# EAGLE design EchoHelloBoard2 (EAGLE 7.2.0)
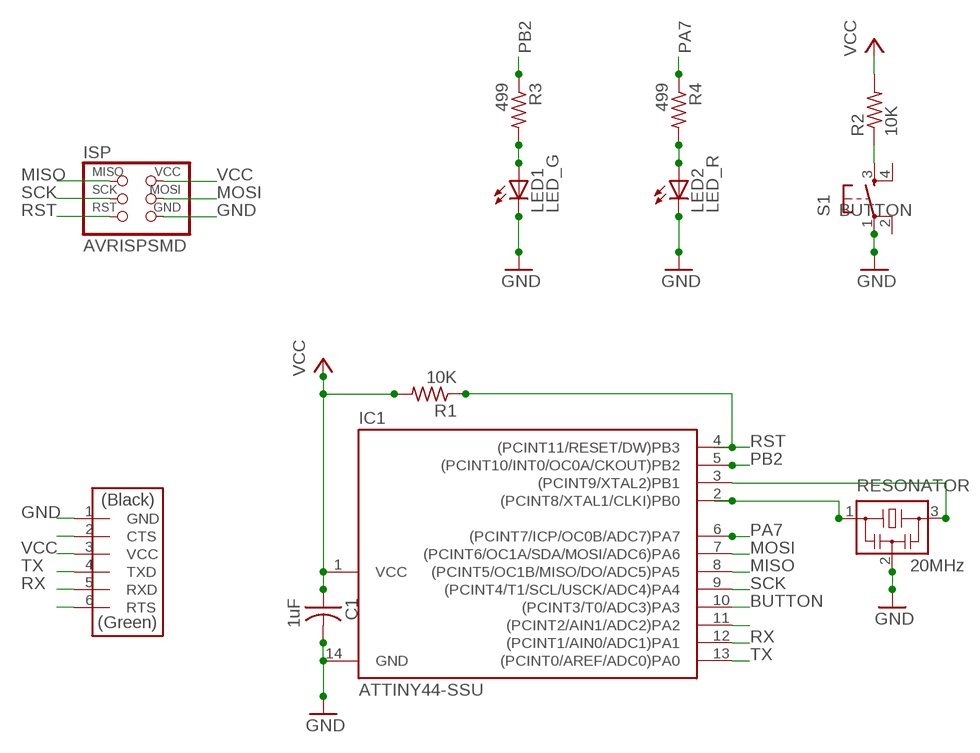
[diagram p0: schematic, sheet 1]

## Parts
C1  1uF  CAP-US1206FAB  [C1206FAB]
IC1  ATTINY44-SSU  [SOIC14]
ISP  AVRISPSMD  [2X03SMD]
LED1  LED_G  LEDFAB1206  [LED1206FAB]
LED2  LED_R  LEDFAB1206  [LED1206FAB]
R1  10K  RES-US1206FAB  [R1206FAB]
R2  10K  RES-US1206FAB  [R1206FAB]
R3  499  RES-US1206FAB  [R1206FAB]
R4  499  RES-US1206FAB  [R1206FAB]
RESONATOR  20MHz  RESONATOR  [EFOBM]
S1  6MM_SWITCH6MM_SWITCH  [6MM_SWITCH]
U$2  FTDI-SMD-HEADER  [1X06SMD]

## Nets
BUTTON: IC1.10((PCINT3/T0/ADC3)PA3) R2.1 S1.3(S)
GND: C1.2 IC1.14(GND) ISP.6(GND) LED1.2(C) LED2.2(C) RESONATOR.2 S1.1(P) U$2.1(GND)
MISO: IC1.8((PCINT5/OC1B/MISO/DO/ADC5)PA5) ISP.1(MISO)
MOSI: IC1.7((PCINT6/OC1A/SDA/MOSI/ADC6)PA6) ISP.4(MOSI)
N$1: IC1.3((PCINT9/XTAL2)PB1) RESONATOR.3
N$3: IC1.2((PCINT8/XTAL1/CLKI)PB0) RESONATOR.1
N$5: LED1.1(A) R3.2
N$6: LED2.1(A) R4.2
N$10: IC1.11((PCINT2/AIN1/ADC2)PA2)
N$19: U$2.2(CTS)
N$23: U$2.6(RTS)
PA7: IC1.6((PCINT7/ICP/OC0B/ADC7)PA7) R4.1
PB2: IC1.5((PCINT10/INT0/OC0A/CKOUT)PB2) R3.1
RST: IC1.4((PCINT11/RESET/DW)PB3) ISP.5(RST) R1.1
RX: IC1.12((PCINT1/AIN0/ADC1)PA1) U$2.5(RXD)
SCK: IC1.9((PCINT4/T1/SCL/USCK/ADC4)PA4) ISP.3(SCK)
TX: IC1.13((PCINT0/AREF/ADC0)PA0) U$2.4(TXD)
VCC: C1.1 IC1.1(VCC) ISP.2(VCC) R1.2 R2.2 U$2.3(VCC)
Unconnected: S1.2(P1) S1.4(S1)

## Library data of the parts
C1 = fab:CAP-US
IC1 = fab:ATTINY44
ISP = fab:AVRISP
LED1 LED2 = fab:LED: LED
R1-R4 = fab:RES-US: Resistor (US Symbol) Variants with postfix FAB are widened to allow the routing of internal traces
RESONATOR = fab:RESONATOR
S1 = fab:6MM_SWITCH: OMRON SWITCH
U$2 = fab:FTDI-SMD-HEADER

## Board
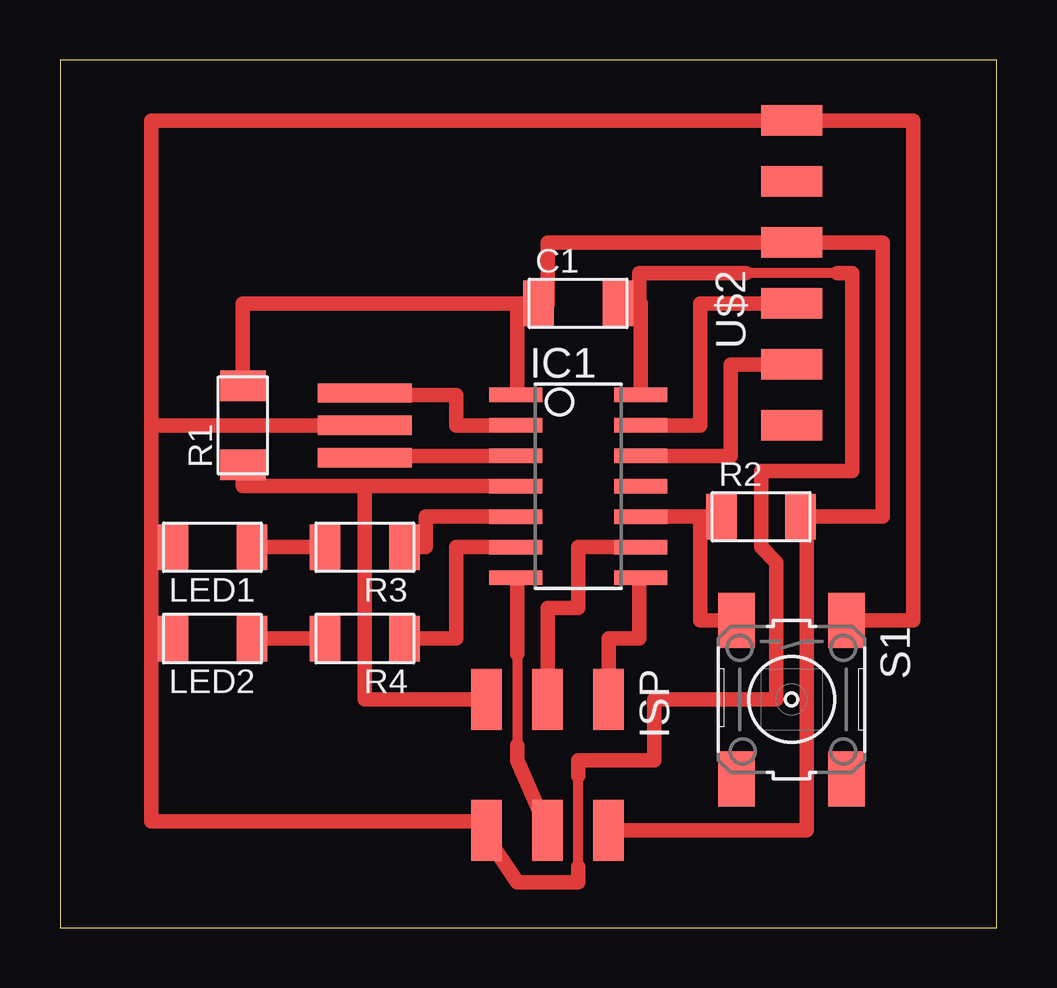
[diagram p1: board, top side]

Size 39.04 x 36.19 mm. Coordinates in mm from the lower left corner, seen from the top.
Outline: 0,0 39.04,0 39.04,36.19 0,36.19 0,0
Copper layers (1*16): Top 0.035mm / dielectric 1.5mm / Bottom 0.035mm
Design rules "default": minimum track width 10mil, minimum drill 24mil, track to track 8mil, track to pad 8mil, pad to pad 8mil, via to via 8mil, smd to smd 8mil, copper to edge 40mil, drill to drill 8mil, minimum pad ring 10mil, minimum via ring 8mil, stop-mask expansion 4mil, vias tented up to drill 0mil, thermal gap 10mil

### Footprints (pad centres in the part's own frame; a part is rotated, then mirrored left to right if it is on the bottom)
C1206FAB = smd 1.27 x 1.905: 1 -1.651,0; 2 1.651,0
SOIC14 = smd 0.61 x 2.21: 1 -3.81,-2.603; 2 -2.54,-2.603; 3 -1.27,-2.603; 4 0,-2.603; 5 1.27,-2.603; 6 2.54,-2.603; 7 3.81,-2.603; 8 3.81,2.603; 9 2.54,2.603; 10 1.27,2.603; 11 0,2.603; 12 -1.27,2.603; 13 -2.54,2.603; 14 -3.81,2.603
2X03SMD = smd 2.54 x 1.27: 1 -2.54,2.54; 2 2.92,2.54; 3 -2.54,0; 4 2.92,0; 5 -2.54,-2.54; 6 2.92,-2.54
LED1206FAB = smd 1.27 x 1.905: 1 -1.651,0; 2 1.651,0
R1206FAB = smd 1.27 x 1.905: 1 -1.651,0; 2 1.651,0
EFOBM = smd 0.8 x 3.9: 1 -1.35,0; 2 0,0; 3 1.35,0
6MM_SWITCH = smd 2.286 x 1.524: 1 -3.302,2.286; 2 3.302,2.286; 3 -3.302,-2.286; 4 3.302,-2.286
1X06SMD = smd 2.54 x 1.27: 1 0,6.35; 2 0,3.81; 3 0,1.27; 4 0,-1.27; 5 0,-3.81; 6 0,-6.35

### Placement (x,y rotation side)
C1  21.59,26.03 0 top
IC1  21.59,18.41 270 top
ISP  20.32,6.98 270 top
LED1  6.35,15.88 180 top
LED2  6.35,12.06 180 top
R1  7.62,20.95 90 top
R2  29.21,17.14 0 top
R3  12.7,15.88 180 top
R4  12.7,12.06 180 top
RESONATOR  12.7,20.95 270 top
S1  30.48,9.52 270 top
U$2  30.48,27.3 0 top

### Tracks (layer width: path | path; a pad name or v marks a point on that pad's centre or on a via)
BUTTON
  Top 0.61: IC1.10 26.67,17.14 | 26.67,17.14 R2.1 | S1.3 26.67,12.83 26.67,17.14
GND
  Top 0.406: 32.38,27.3 28.57,27.3 | 21.59,1.91 21.59,6.35
  Top 0.61: C1.2 24.13,26.03 | IC1.14 24.19,26.03 24.13,26.03 | 3.81,20.95 3.81,33.66 U$2.1 35.56,33.66 35.56,12.83 S1.1 | 3.81,20.95 3.81,15.88 | 3.81,15.88 3.81,12.06 | 3.81,12.06 3.81,4.45 17.78,4.45 ISP.6 17.78,3.81 19.05,1.91 21.59,1.91 21.59,2.54 | LED2.2 3.81,12.06 | RESONATOR.2 3.81,20.95 | LED1.2 3.81,15.88 | 24.13,26.03 24.13,27.3 28.57,27.3 | 21.59,6.35 21.59,6.98 24.77,6.98 24.77,9.52 29.84,9.52 29.84,15.24 29.21,15.88 29.21,19.05 33.02,19.05 33.02,27.3 32.38,27.3
MISO
  Top 0.61: IC1.8 24.13,14.6 24.13,12.06 22.86,12.06 ISP.1
MOSI
  Top 0.406: 19.05,11.43 19.05,7.62
  Top 0.61: ISP.4 19.05,6.98 19.05,7.62 | IC1.7 19.05,14.6 19.05,11.43
N$1
  Top 0.61: IC1.3 12.7,19.69 RESONATOR.3
N$3
  Top 0.61: IC1.2 16.51,20.95 16.51,22.23 12.7,22.23 RESONATOR.1
N$5
  Top 0.61: R3.2 LED1.1
N$6
  Top 0.61: R4.2 LED2.1
PA7
  Top 0.61: IC1.6 16.51,15.88 16.51,12.06 R4.1
PB2
  Top 0.61: IC1.5 15.24,17.14 15.24,15.88 R3.1
RST
  Top 0.61: IC1.4 12.7,18.41 | 12.7,18.41 7.62,18.41 R1.1 | ISP.5 12.7,9.52 12.7,18.41
RX
  Top 0.61: U$2.5 27.94,23.49 27.94,19.69 IC1.12
SCK
  Top 0.61: IC1.9 21.59,15.88 21.59,13.34 20.32,13.34 ISP.3
TX
  Top 0.61: U$2.4 26.67,26.03 26.67,20.95 IC1.13
VCC
  Top 0.61: R1.2 7.62,26.03 19.05,26.03 | 19.05,26.03 C1.1 20.32,26.03 20.32,28.58 U$2.3 34.29,28.58 34.29,17.14 R2.2 31.11,16.51 31.11,4.06 ISP.2 | IC1.1 19.05,22.23 19.05,26.03